# Altium schematic sheet motor_driver.SchDoc
size A; SheetNumber: 2; SheetTotal: 2
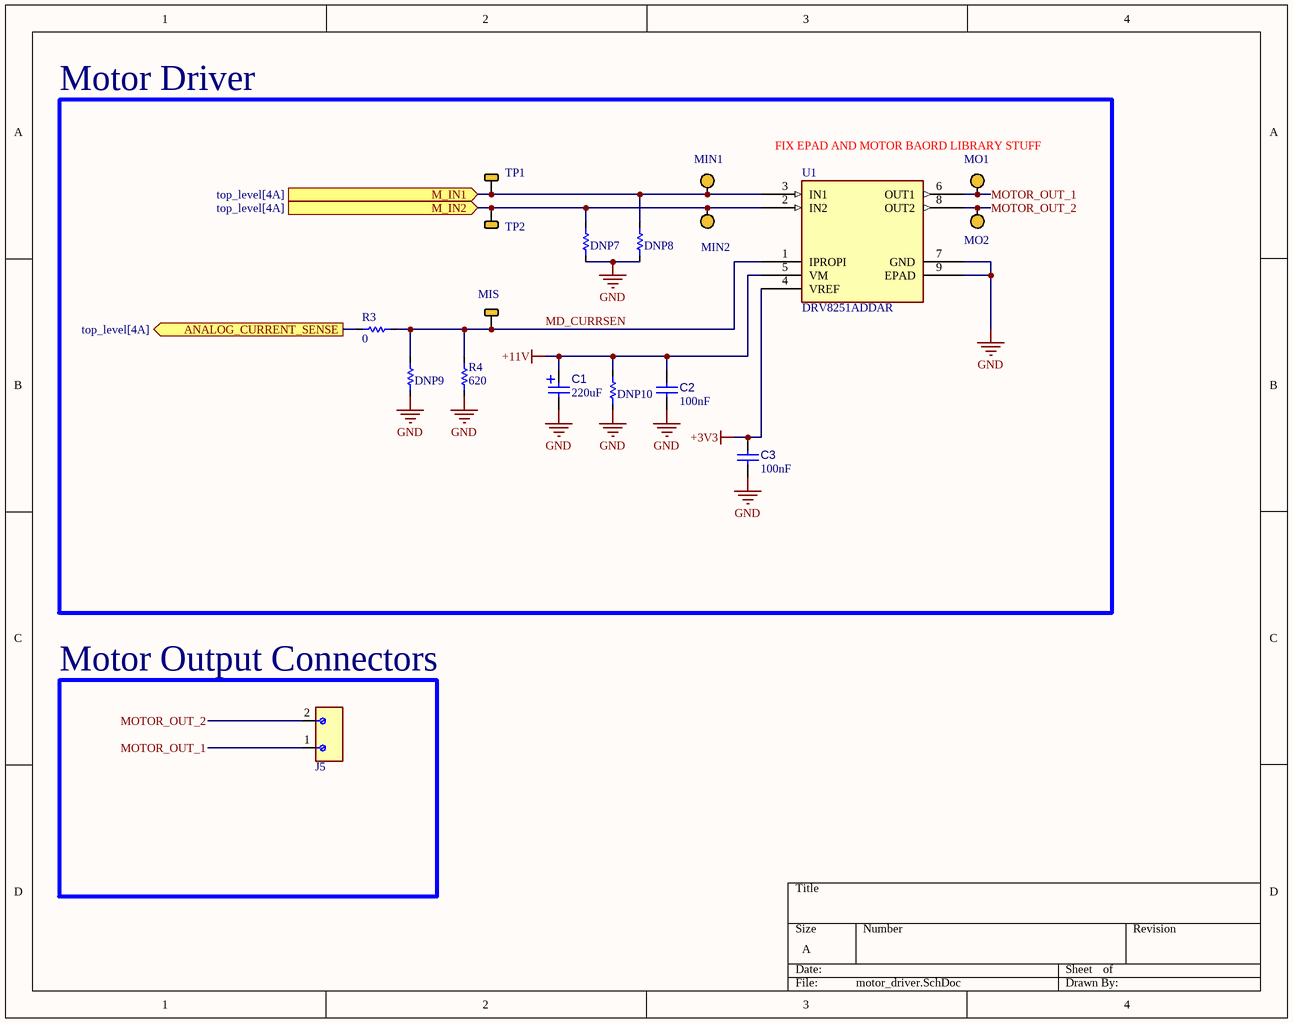
[diagram p0: motor_driver.SchDoc]

## Parts
C1  value 220uF  [C - 860020574012]  (hidden comment: 860020574012)
C2  value 100nF  [CAP_0603]  (hidden comment: C - CAP CER 100nF 100V 10% 0603)
C3  value 100nF  [CAP_0603]  (hidden comment: C - CAP CER 100nF 100V 10% 0603)
DNP7  DNP - DNP PAD 0603  [DNP 0603]  (value not drawn)
DNP8  DNP - DNP PAD 0603  [DNP 0603]  (value not drawn)
DNP9  DNP - DNP PAD 0603  [DNP 0603]  (value not drawn)
DNP10  DNP - DNP PAD 0603  [DNP 0603]  (value not drawn)
J5  J - 691137710002  [J - 691137710002]  (value not drawn)
MIN1  TP - SMD Pad Test Point Circular  [TP - SMD Pad Testpoint]  (value not drawn)
MIN2  TP - SMD Pad Test Point Circular  [TP - SMD Pad Testpoint]  (value not drawn)
MIS  SMD Pad Testpoint Rectangular (Signal)  [SMD Pad Testpoint Rectangular (Signal)]  (value not drawn)
MO1  TP - SMD Pad Test Point Circular  [TP - SMD Pad Testpoint]  (value not drawn)
MO2  TP - SMD Pad Test Point Circular  [TP - SMD Pad Testpoint]  (value not drawn)
R3  value 0  [RES 0603]  (hidden comment: R - RES 0R 0.1W N/A% 0603)
R4  value 620  [RES 0603]  (hidden comment: R - RES 620R 0.33W 1% 0603)
TP1  SMD Pad Testpoint Rectangular (Signal)  [SMD Pad Testpoint Rectangular (Signal)]  (value not drawn)
TP2  SMD Pad Testpoint Rectangular (Signal)  [SMD Pad Testpoint Rectangular (Signal)]  (value not drawn)
U1  DRV8251ADDAR  [U - DRV8251ADDAR]

## Blocks framed on the sheet
Motor Driver: C1-C3 DNP7-DNP10 MIN1 MIN2 MIS MO1 MO2 R3 R4 TP1 TP2 U1
Motor Output Connectors: J5

## Ports
ANALOG_CURRENT_SENSE (out, see top_level[4A]), M_IN1 (in, see top_level[4A]), M_IN2 (in, see top_level[4A])

## Nets
+3V3: C3.2 U1.4(VREF)
+11V: C1.1(POS) C2.2 DNP10.2 U1.5(VM)
GND: C1.2(NEG) C2.1 C3.1 DNP7.1 DNP8.1 DNP9.1 DNP10.1 R4.1 U1.7(GND) U1.9(EPAD)
ANALOG_CURRENT_SENSE: R3.1 ; port ANALOG_CURRENT_SENSE
M_IN1: DNP8.2 MIN1.1 TP1.1 U1.3(IN1) ; port M_IN1
M_IN2: DNP7.2 MIN2.1 TP2.1 U1.2(IN2) ; port M_IN2
MD_CURRSEN: DNP9.2 MIS.1 R3.2 R4.2 U1.1(IPROPI)
MOTOR_OUT_1: J5.1 MO1.1 U1.6(OUT1)
MOTOR_OUT_2: J5.2 MO2.1 U1.8(OUT2)

## Notes on the sheet
- FIX EPAD AND MOTOR BAORD LIBRARY STUFF

## Library data of the parts
C1 = C - CAP ELC 220uF 35V 20% CAN: 860020574012 - 220 µF 35 V Aluminum Electrolytic Capacitors Radial, Can 2000 Hrs @ 105°C; Parameter 2: *
C2 C3 = C - CAP CER 100nF 100V 10% 0603: GRM188R72A104KA35D - 0.1 µF ±10% 100V Ceramic Capacitor X7R 0603 (1608 Metric); Parameter 2: *
J5 = J - 691137710002: 691137710002 - 2 Position Wire to Board Terminal Block Horizontal with Board 0.197" (5.00mm) Through Hole
MIN1 MIN2 MO1 MO2 = TP - SMD Pad Test Point Circular: Pad Test Point, Circular, 1mm Diameter.
MIS TP1 TP2 = SMD Pad Testpoint Rectangular (Signal): SMD Pad Test Point, No Stencil, Rectangular, 1mm Long, 0.3 (12mil) Wide, For Signal Traces.
R3 = R - RES 0R 0.1W N/A% 0603: ERJ-3GEY0R00V - 0 Ohms Jumper Chip Resistor 0603 (1608 Metric) Automotive AEC-Q200 Thick Film
R4 = R - RES 620R 0.33W 1% 0603: ERJ-PA3F6200V - 620 Ohms ±1% 0.333W, 1/3W Chip Resistor 0603 (1608 Metric) Automotive AEC-Q200, Pulse Withstanding Thick Film
U1 = U - DRV8251ADDAR: DRV8251ADDAR - 50-V, 4.1-A H-bridge motor driver with integrated current regulation & current-sense feedback 8-SO PowerPAD -40 to 150